# EAGLE schematic ESP12E Breakout Adapter (EAGLE 7.2.0)
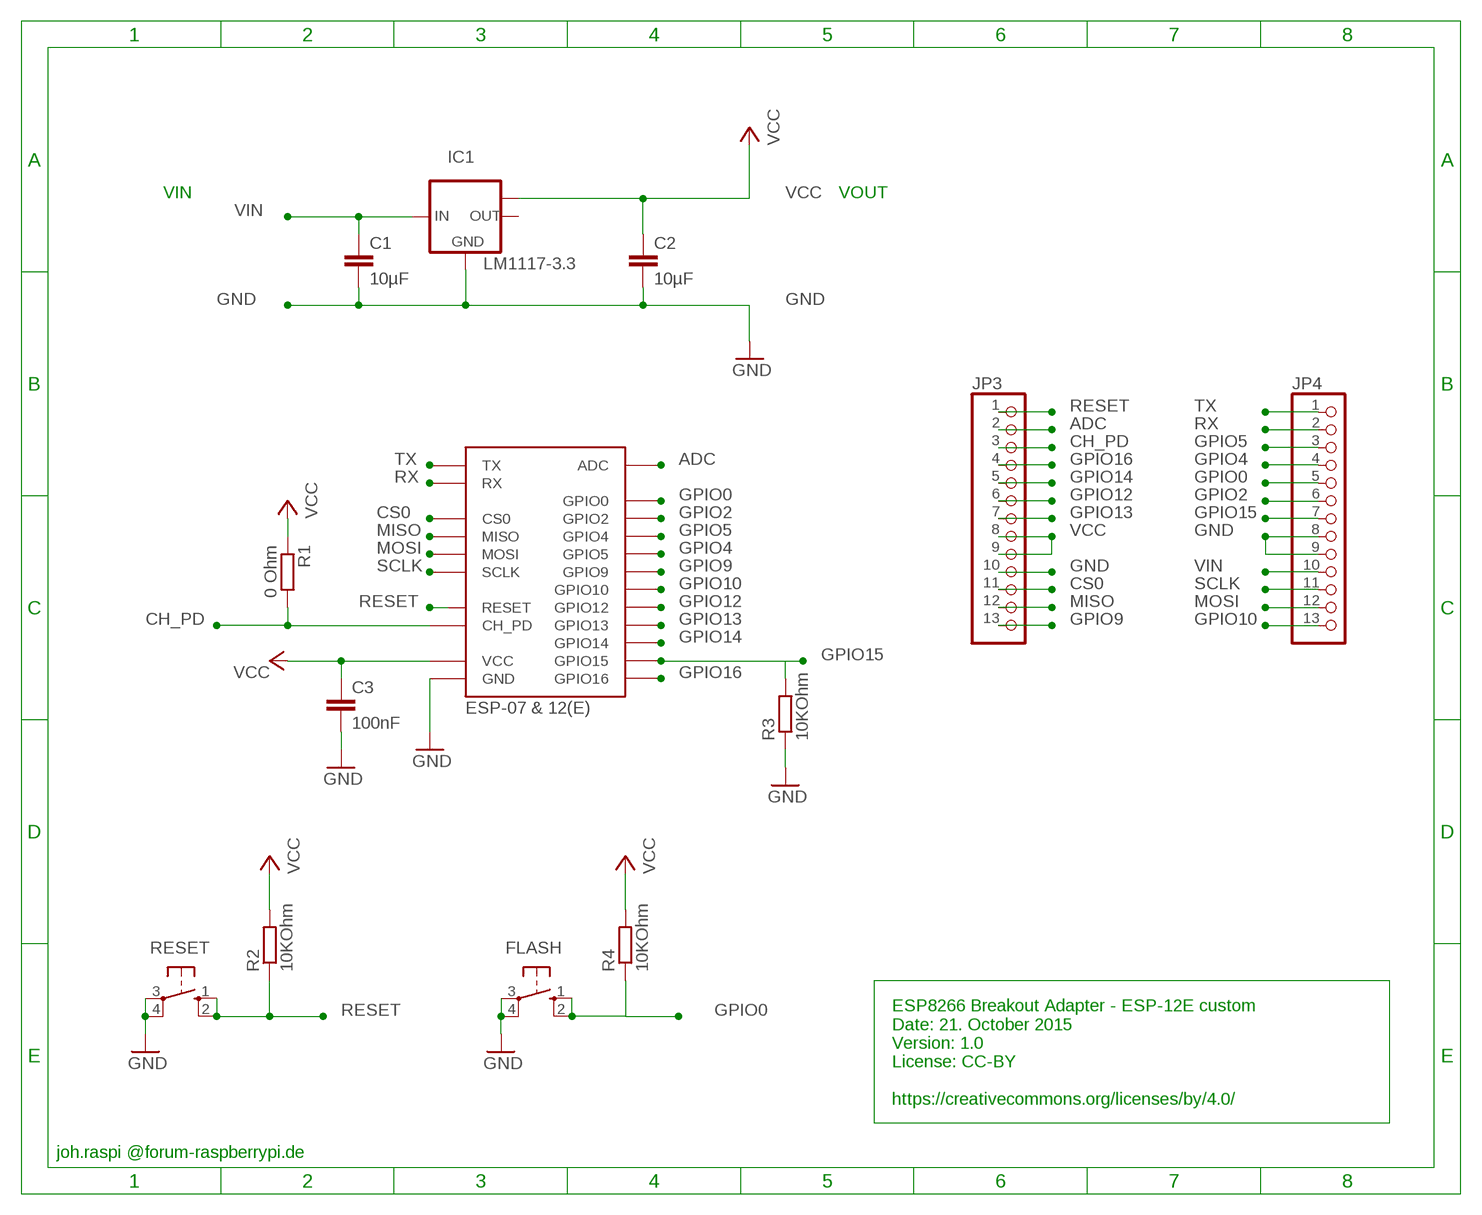
[diagram p0: schematic, sheet 1]

## Parts
C1  10µF  C-EUC0805K  [C0805K]
C2  10µF  C-EUC0805K  [C0805K]
C3  100nF  C-EUC0805K  [C0805K]
ESP8266  ESP-07 & 12(E)  ESP-12-E  [ESP-12-E]
FLASH_SWITCH  FLASH  10-XX  [B3F-10XX]
IC1  LM1117-3.3  LM1117MPX-3.3  [SOT223]
JP3  PINHD-1X13  [1X13]
JP4  PINHD-1X13  [1X13]
R1  0 Ohm  R-EU_R0805  [R0805]
R2  10KOhm  R-EU_R0805  [R0805]
R3  10KOhm  R-EU_R0805  [R0805]
R4  10KOhm  R-EU_R0805  [R0805]
RESET_SWITCH  RESET  10-XX  [B3F-10XX]

## Nets
ADC: ESP8266.ADC JP3.2
CH_PD: ESP8266.CH_PD JP3.3 R1.2
CS0: ESP8266.CS0 JP3.11
GND [a]: C1.2 C2.2 C3.2 ESP8266.GND FLASH_SWITCH.3(P) FLASH_SWITCH.4(P1) IC1.1(GND) JP3.10 JP4.8 JP4.9 R3.1 RESET_SWITCH.3(P) RESET_SWITCH.4(P1)
GPIO0: ESP8266.GPIO0 FLASH_SWITCH.1(S) FLASH_SWITCH.2(S1) JP4.5 R4.1
GPIO2: ESP8266.GPIO2 JP4.6
GPIO4: ESP8266.GPIO5 JP4.4
GPIO5: ESP8266.GPIO4 JP4.3
GPIO9: ESP8266.GPIO9 JP3.13
GPIO10: ESP8266.GPIO10 JP4.13
GPIO12: ESP8266.GPIO12 JP3.6
GPIO13: ESP8266.GPIO13 JP3.7
GPIO14: ESP8266.GPIO14 JP3.5
GPIO15: ESP8266.GPIO15 JP4.7 R3.2
GPIO16: ESP8266.GPIO16 JP3.4
MISO: ESP8266.MISO JP3.12
MOSI: ESP8266.MOSI JP4.12
RESET: ESP8266.RESET JP3.1 R2.1 RESET_SWITCH.1(S) RESET_SWITCH.2(S1)
RX: ESP8266.RX JP4.2
SCLK: ESP8266.SCLK JP4.11
TX: ESP8266.TX JP4.1
VCC: C2.1 C3.1 ESP8266.VCC IC1.TAB(OUT1) JP3.8 JP3.9 R1.1 R2.2 R4.2
VIN: C1.1 IC1.3(IN) JP4.10
Unconnected: IC1.2(OUT)

## Notes on the sheet
- VIN | VOUT
- ESP8266 Breakout Adapter - ESP-12E custom
  Date: 21. October 2015
  Version: 1.0
  License: CC-BY
  
  https://creativecommons.org/licenses/by/4.0/
- joh.raspi @forum-raspberrypi.de

## Library data of the parts
C1-C3 = rcl:C-EU: CAPACITOR, European symbol
ESP8266 = johs_esp8266_lib_frank_esp12e_mod:ESP-12-E: ESP8266 Wifi Module ESP-12-E; DIMENSIONS: 24.0 x 16.0 mm; PINS: 22; PITCH: 0.078" / 2 mm
FLASH_SWITCH RESET_SWITCH = switch-omron:10-XX: OMRON SWITCH; MPN: B3F-1000; OC_FARNELL: 176432; OC_NEWARK: 36M3542
IC1 = lm1117:LM1117MPX-*
JP3 JP4 = pinhead:PINHD-1X13: PIN HEADER
R1-R4 = rcl:R-EU_: RESISTOR, European symbol

## Net classes
1 a: width 0.203 mm, drill 0.305 mm, clearance 0.203 mm